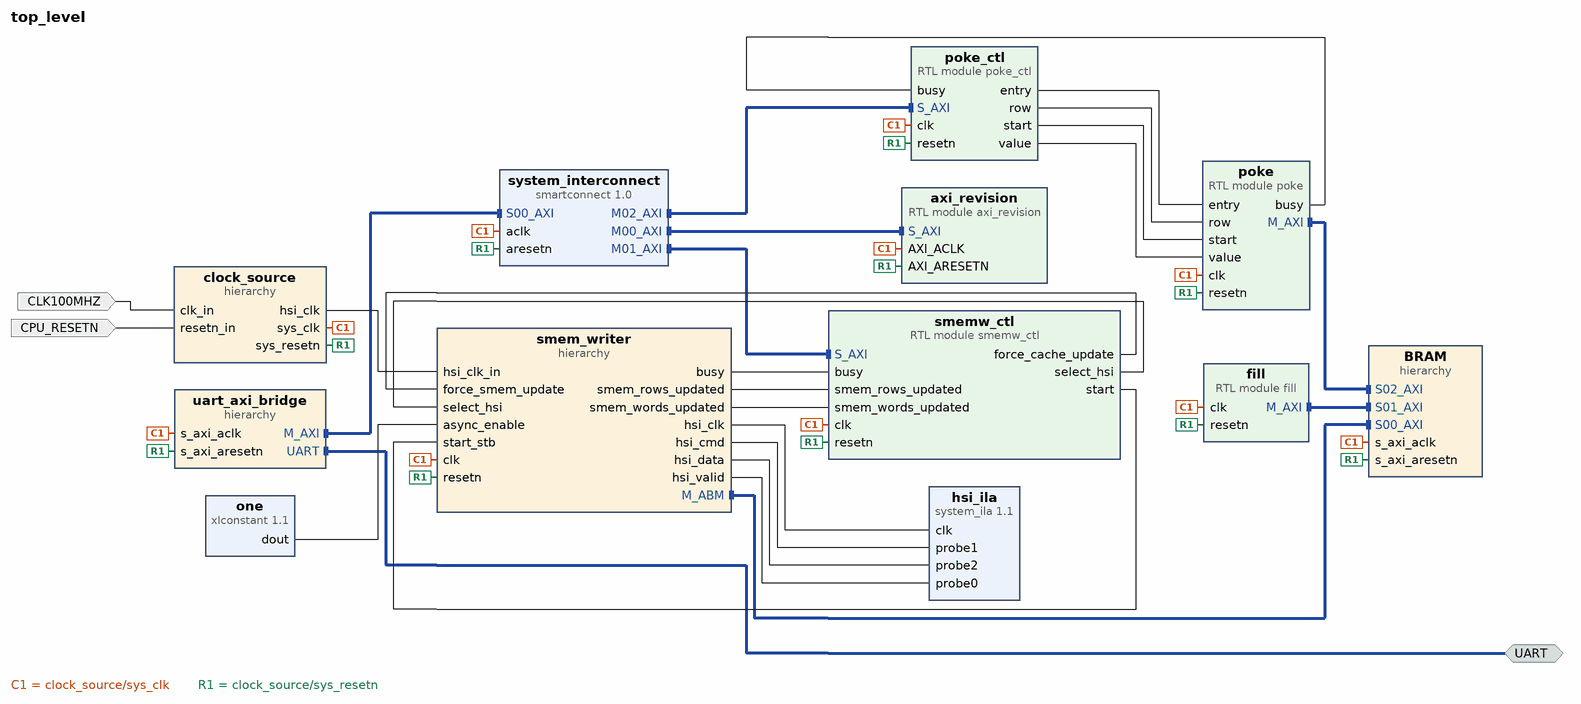
[diagram p0: block diagram of the top level]
# Vivado block design top_level, xc7a100tcsg324-1, Vivado 2021.1
create_bd_design top_level

create_bd_intf_port -mode Master -vlnv xilinx.com:interface:uart_rtl:1.0 UART
create_bd_port -dir I -type clk CLK100MHZ
create_bd_port -dir I -type rst CPU_RESETN

create_bd_cell -type hier clock_source
create_bd_cell -type hier uart_axi_bridge
create_bd_cell -type ip -vlnv xilinx.com:ip:smartconnect:1.0 system_interconnect
set_property -dict {CONFIG.NUM_MI 3 CONFIG.NUM_SI 1} [get_bd_cells system_interconnect]
create_bd_cell -type module -reference axi_revision axi_revision
create_bd_cell -type hier BRAM
create_bd_cell -type module -reference poke_ctl poke_ctl
create_bd_cell -type hier smem_writer
create_bd_cell -type ip -vlnv xilinx.com:ip:xlconstant:1.1 one
create_bd_cell -type ip -vlnv xilinx.com:ip:system_ila:1.1 hsi_ila
set_property -dict [list \
  CONFIG.C_MON_TYPE NATIVE \
  CONFIG.C_NUM_OF_PROBES 3 \
  CONFIG.C_SLOT_0_INTF_TYPE xilinx.com:interface:axis_rtl:1.0 \
] [get_bd_cells hsi_ila]
create_bd_cell -type module -reference smemw_ctl smemw_ctl
create_bd_cell -type module -reference fill fill
create_bd_cell -type module -reference poke poke

# ---- hierarchy /clock_source ----
current_bd_instance /clock_source
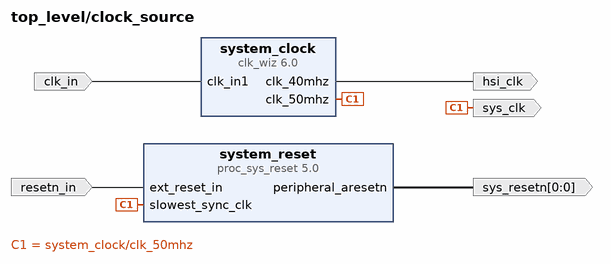
[diagram p1: block diagram inside /clock_source]
create_bd_pin -dir I -type clk clk_in
create_bd_pin -dir I -type rst resetn_in
create_bd_pin -dir O -type clk sys_clk
create_bd_pin -dir O -from 0 -to 0 sys_resetn
create_bd_pin -dir O hsi_clk

create_bd_cell -type ip -vlnv xilinx.com:ip:clk_wiz:6.0 system_clock
set_property -dict [list \
  CONFIG.CLKOUT1_JITTER 151.636 \
  CONFIG.CLKOUT1_REQUESTED_OUT_FREQ 50.00 \
  CONFIG.CLKOUT2_JITTER 159.371 \
  CONFIG.CLKOUT2_PHASE_ERROR 98.575 \
  CONFIG.CLKOUT2_REQUESTED_OUT_FREQ 40.00 \
  CONFIG.CLKOUT2_USED true \
  CONFIG.CLK_OUT1_PORT clk_50mhz \
  CONFIG.CLK_OUT2_PORT clk_40mhz \
  CONFIG.MMCM_CLKOUT0_DIVIDE_F 20.000 \
  CONFIG.MMCM_CLKOUT1_DIVIDE 25 \
  CONFIG.NUM_OUT_CLKS 2 \
  CONFIG.USE_LOCKED false \
  CONFIG.USE_RESET false \
] [get_bd_cells system_clock]
create_bd_cell -type ip -vlnv xilinx.com:ip:proc_sys_reset:5.0 system_reset

# ---- hierarchy /uart_axi_bridge ----
current_bd_instance /uart_axi_bridge
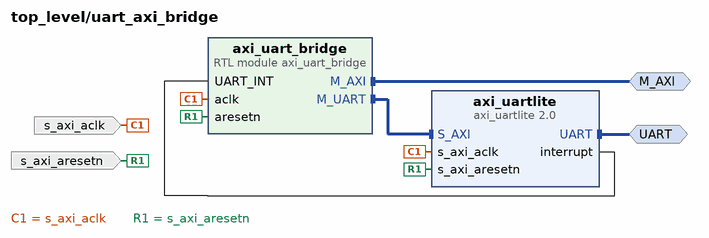
[diagram p2: block diagram inside /uart_axi_bridge]
create_bd_intf_pin -mode Master -vlnv xilinx.com:interface:uart_rtl:1.0 UART
create_bd_intf_pin -mode Master -vlnv xilinx.com:interface:aximm_rtl:1.0 M_AXI
create_bd_pin -dir I -type clk s_axi_aclk
create_bd_pin -dir I -type rst s_axi_aresetn

create_bd_cell -type module -reference axi_uart_bridge axi_uart_bridge
create_bd_cell -type ip -vlnv xilinx.com:ip:axi_uartlite:2.0 axi_uartlite
set_property -dict {CONFIG.C_BAUDRATE 115200} [get_bd_cells axi_uartlite]

# ---- hierarchy /BRAM ----
current_bd_instance /BRAM
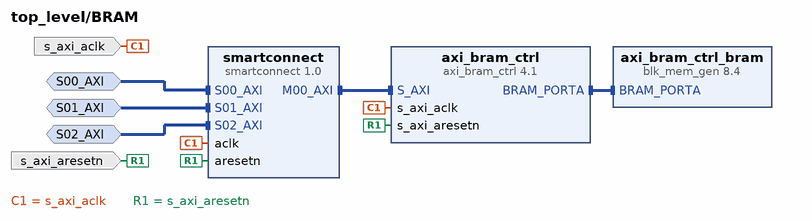
[diagram p3: block diagram inside /BRAM]
create_bd_intf_pin -mode Slave -vlnv xilinx.com:interface:aximm_rtl:1.0 S00_AXI
create_bd_intf_pin -mode Slave -vlnv xilinx.com:interface:aximm_rtl:1.0 S01_AXI
create_bd_intf_pin -mode Slave -vlnv xilinx.com:interface:aximm_rtl:1.0 S02_AXI
create_bd_pin -dir I -type clk s_axi_aclk
create_bd_pin -dir I -type rst s_axi_aresetn

create_bd_cell -type ip -vlnv xilinx.com:ip:axi_bram_ctrl:4.1 axi_bram_ctrl
set_property -dict {CONFIG.DATA_WIDTH 512 CONFIG.SINGLE_PORT_BRAM 1} [get_bd_cells axi_bram_ctrl]
create_bd_cell -type ip -vlnv xilinx.com:ip:blk_mem_gen:8.4 axi_bram_ctrl_bram
create_bd_cell -type ip -vlnv xilinx.com:ip:smartconnect:1.0 smartconnect
set_property -dict {CONFIG.NUM_SI 3} [get_bd_cells smartconnect]

# ---- hierarchy /smem_writer ----
current_bd_instance /smem_writer
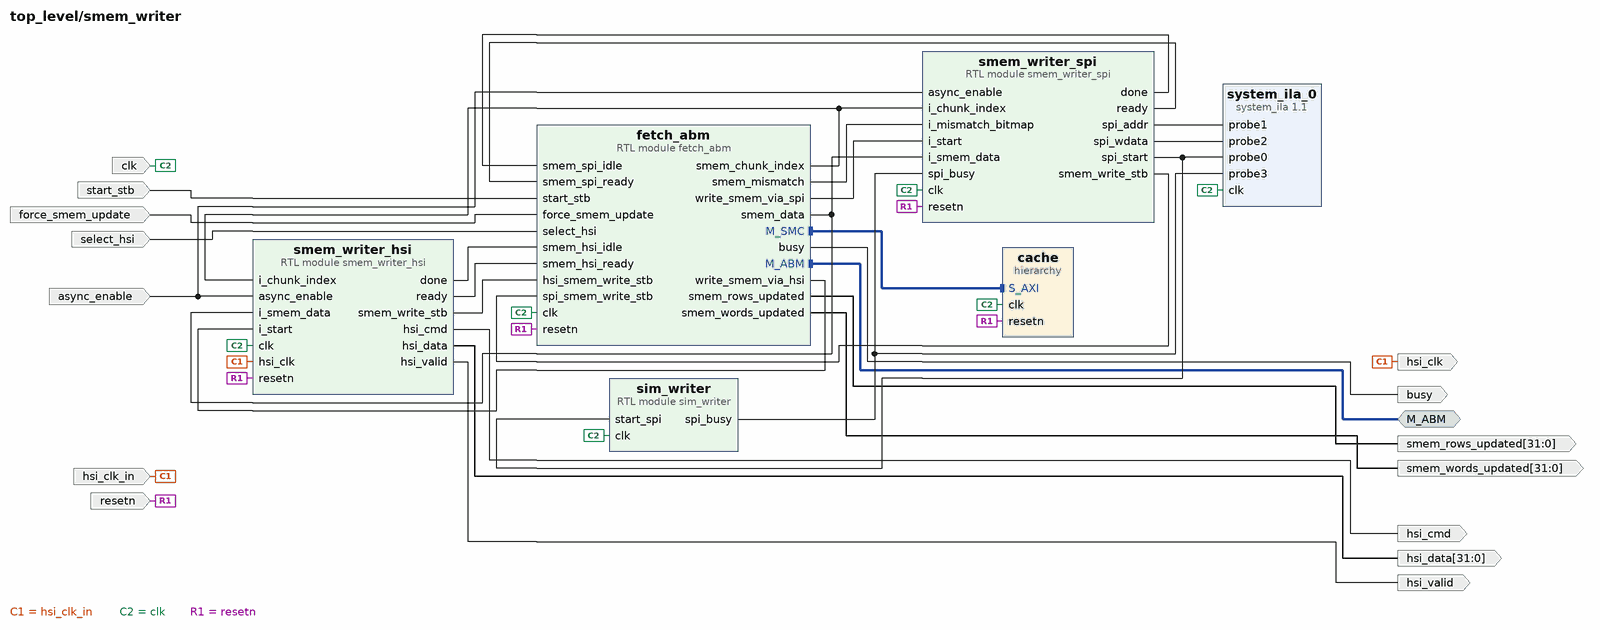
[diagram p4: block diagram inside /smem_writer]
create_bd_intf_pin -mode Master -vlnv xilinx.com:interface:aximm_rtl:1.0 M_ABM
create_bd_pin -dir I -type clk clk
create_bd_pin -dir I -type rst resetn
create_bd_pin -dir I start_stb
create_bd_pin -dir I select_hsi
create_bd_pin -dir I async_enable
create_bd_pin -dir I hsi_clk_in
create_bd_pin -dir O -from 31 -to 0 hsi_data
create_bd_pin -dir O hsi_cmd
create_bd_pin -dir O hsi_valid
create_bd_pin -dir O hsi_clk
create_bd_pin -dir I force_smem_update
create_bd_pin -dir O -from 31 -to 0 smem_rows_updated
create_bd_pin -dir O -from 31 -to 0 smem_words_updated
create_bd_pin -dir O busy

create_bd_cell -type hier cache
create_bd_cell -type ip -vlnv xilinx.com:ip:system_ila:1.1 system_ila_0
set_property -dict [list \
  CONFIG.C_DATA_DEPTH 2048 \
  CONFIG.C_MON_TYPE NATIVE \
  CONFIG.C_NUM_MONITOR_SLOTS 2 \
  CONFIG.C_NUM_OF_PROBES 4 \
  CONFIG.C_SLOT 1 \
  CONFIG.C_SLOT_0_INTF_TYPE xilinx.com:interface:axis_rtl:1.0 \
  CONFIG.C_SLOT_1_INTF_TYPE xilinx.com:interface:axis_rtl:1.0 \
] [get_bd_cells system_ila_0]
create_bd_cell -type module -reference sim_writer sim_writer
create_bd_cell -type module -reference smem_writer_spi smem_writer_spi
create_bd_cell -type module -reference smem_writer_hsi smem_writer_hsi
create_bd_cell -type module -reference fetch_abm fetch_abm
set_property -dict {CONFIG.BRAM_SIZE 0x00001000} [get_bd_cells fetch_abm]

# ---- hierarchy /smem_writer/cache ----
current_bd_instance /smem_writer/cache
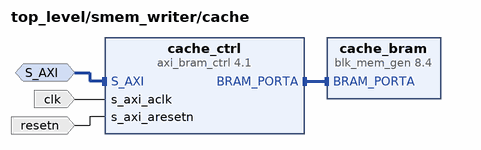
[diagram p5: block diagram inside /smem_writer/cache]
create_bd_intf_pin -mode Slave -vlnv xilinx.com:interface:aximm_rtl:1.0 S_AXI
create_bd_pin -dir I -type clk clk
create_bd_pin -dir I -type rst resetn

create_bd_cell -type ip -vlnv xilinx.com:ip:axi_bram_ctrl:4.1 cache_ctrl
set_property -dict {CONFIG.DATA_WIDTH 512 CONFIG.SINGLE_PORT_BRAM 1} [get_bd_cells cache_ctrl]
create_bd_cell -type ip -vlnv xilinx.com:ip:blk_mem_gen:8.4 cache_bram

# ---- connections ----

current_bd_instance /clock_source
connect_bd_net -net clk_in1_0_1 [get_bd_pins clk_in] [get_bd_pins system_clock/clk_in1]
connect_bd_net -net ext_reset_in_0_1 [get_bd_pins resetn_in] [get_bd_pins system_reset/ext_reset_in]
connect_bd_net -net system_clock_clk_100mhz [get_bd_pins system_clock/clk_50mhz] [get_bd_pins sys_clk] [get_bd_pins system_reset/slowest_sync_clk]
connect_bd_net [get_bd_pins system_clock/clk_40mhz] [get_bd_pins hsi_clk]
connect_bd_net [get_bd_pins system_reset/peripheral_aresetn] [get_bd_pins sys_resetn]

current_bd_instance /uart_axi_bridge
connect_bd_intf_net [get_bd_intf_pins M_AXI] [get_bd_intf_pins axi_uart_bridge/M_AXI]
connect_bd_intf_net [get_bd_intf_pins axi_uart_bridge/M_UART] [get_bd_intf_pins axi_uartlite/S_AXI]
connect_bd_intf_net [get_bd_intf_pins UART] [get_bd_intf_pins axi_uartlite/UART]
connect_bd_net [get_bd_pins axi_uartlite/interrupt] [get_bd_pins axi_uart_bridge/UART_INT]
connect_bd_net -net source_100mhz_sys_clk [get_bd_pins s_axi_aclk] [get_bd_pins axi_uartlite/s_axi_aclk] [get_bd_pins axi_uart_bridge/aclk]
connect_bd_net -net source_100mhz_sys_resetn [get_bd_pins s_axi_aresetn] \
  [get_bd_pins axi_uartlite/s_axi_aresetn] [get_bd_pins axi_uart_bridge/aresetn]

current_bd_instance /BRAM
connect_bd_intf_net [get_bd_intf_pins S00_AXI] [get_bd_intf_pins smartconnect/S00_AXI]
connect_bd_intf_net [get_bd_intf_pins S01_AXI] [get_bd_intf_pins smartconnect/S01_AXI]
connect_bd_intf_net [get_bd_intf_pins S02_AXI] [get_bd_intf_pins smartconnect/S02_AXI]
connect_bd_intf_net [get_bd_intf_pins axi_bram_ctrl_bram/BRAM_PORTA] [get_bd_intf_pins axi_bram_ctrl/BRAM_PORTA]
connect_bd_intf_net -intf_net smartconnect_0_M00_AXI [get_bd_intf_pins smartconnect/M00_AXI] [get_bd_intf_pins axi_bram_ctrl/S_AXI]
connect_bd_net -net source_100mhz_sys_clk [get_bd_pins s_axi_aclk] [get_bd_pins axi_bram_ctrl/s_axi_aclk] [get_bd_pins smartconnect/aclk]
connect_bd_net -net source_100mhz_sys_resetn [get_bd_pins s_axi_aresetn] [get_bd_pins axi_bram_ctrl/s_axi_aresetn] [get_bd_pins smartconnect/aresetn]

current_bd_instance /smem_writer
connect_bd_intf_net [get_bd_intf_pins M_ABM] [get_bd_intf_pins fetch_abm/M_ABM]
connect_bd_intf_net -intf_net fetch_abm_M_SHA [get_bd_intf_pins fetch_abm/M_SMC] [get_bd_intf_pins cache/S_AXI]
connect_bd_net [get_bd_pins async_enable] [get_bd_pins smem_writer_spi/async_enable] [get_bd_pins smem_writer_hsi/async_enable]
connect_bd_net -net example_slave_start [get_bd_pins start_stb] [get_bd_pins fetch_abm/start_stb]
connect_bd_net [get_bd_pins fetch_abm/busy] [get_bd_pins busy]
connect_bd_net [get_bd_pins fetch_abm/smem_chunk_index] [get_bd_pins smem_writer_spi/i_chunk_index] [get_bd_pins smem_writer_hsi/i_chunk_index]
connect_bd_net [get_bd_pins fetch_abm/smem_data] [get_bd_pins smem_writer_spi/i_smem_data] [get_bd_pins smem_writer_hsi/i_smem_data]
connect_bd_net [get_bd_pins fetch_abm/smem_mismatch] [get_bd_pins smem_writer_spi/i_mismatch_bitmap]
connect_bd_net [get_bd_pins fetch_abm/smem_rows_updated] [get_bd_pins smem_rows_updated]
connect_bd_net -net fetch_abm_smem_words_update [get_bd_pins fetch_abm/smem_words_updated] [get_bd_pins smem_words_updated]
connect_bd_net [get_bd_pins fetch_abm/write_smem_via_hsi] [get_bd_pins smem_writer_hsi/i_start]
connect_bd_net [get_bd_pins fetch_abm/write_smem_via_spi] [get_bd_pins smem_writer_spi/i_start]
connect_bd_net [get_bd_pins force_smem_update] [get_bd_pins fetch_abm/force_smem_update]
connect_bd_net -net hsi_clk_1 [get_bd_pins hsi_clk_in] [get_bd_pins hsi_clk] [get_bd_pins smem_writer_hsi/hsi_clk]
connect_bd_net [get_bd_pins select_hsi] [get_bd_pins fetch_abm/select_hsi]
connect_bd_net [get_bd_pins sim_writer/spi_busy] [get_bd_pins system_ila_0/probe3] [get_bd_pins smem_writer_spi/spi_busy]
connect_bd_net [get_bd_pins smem_writer_hsi/done] [get_bd_pins fetch_abm/smem_hsi_idle]
connect_bd_net [get_bd_pins smem_writer_hsi/hsi_cmd] [get_bd_pins hsi_cmd]
connect_bd_net [get_bd_pins smem_writer_hsi/hsi_data] [get_bd_pins hsi_data]
connect_bd_net [get_bd_pins smem_writer_hsi/hsi_valid] [get_bd_pins hsi_valid]
connect_bd_net [get_bd_pins smem_writer_hsi/ready] [get_bd_pins fetch_abm/smem_hsi_ready]
connect_bd_net [get_bd_pins smem_writer_hsi/smem_write_stb] [get_bd_pins fetch_abm/hsi_smem_write_stb]
connect_bd_net -net smem_writer_spi_0_done [get_bd_pins smem_writer_spi/done] [get_bd_pins fetch_abm/smem_spi_idle]
connect_bd_net -net smem_writer_spi_0_ready [get_bd_pins smem_writer_spi/ready] [get_bd_pins fetch_abm/smem_spi_ready]
connect_bd_net -net smem_writer_spi_0_spi_addr [get_bd_pins smem_writer_spi/spi_addr] [get_bd_pins system_ila_0/probe1]
connect_bd_net -net smem_writer_spi_0_spi_start [get_bd_pins smem_writer_spi/spi_start] \
  [get_bd_pins system_ila_0/probe0] [get_bd_pins sim_writer/start_spi]
connect_bd_net -net smem_writer_spi_0_spi_wdata [get_bd_pins smem_writer_spi/spi_wdata] [get_bd_pins system_ila_0/probe2]
connect_bd_net [get_bd_pins smem_writer_spi/smem_write_stb] [get_bd_pins fetch_abm/spi_smem_write_stb]
connect_bd_net -net source_100mhz_sys_clk [get_bd_pins clk] \
  [get_bd_pins cache/clk] [get_bd_pins system_ila_0/clk] [get_bd_pins sim_writer/clk] [get_bd_pins smem_writer_spi/clk] \
  [get_bd_pins smem_writer_hsi/clk] [get_bd_pins fetch_abm/clk]
connect_bd_net -net source_100mhz_sys_resetn [get_bd_pins resetn] \
  [get_bd_pins cache/resetn] [get_bd_pins smem_writer_spi/resetn] [get_bd_pins smem_writer_hsi/resetn] \
  [get_bd_pins fetch_abm/resetn]

current_bd_instance /smem_writer/cache
connect_bd_intf_net -intf_net axi_bram_ctrl_BRAM_PORTA [get_bd_intf_pins cache_bram/BRAM_PORTA] [get_bd_intf_pins cache_ctrl/BRAM_PORTA]
connect_bd_intf_net -intf_net fetch_abm_M_SHA [get_bd_intf_pins S_AXI] [get_bd_intf_pins cache_ctrl/S_AXI]
connect_bd_net -net source_100mhz_sys_clk [get_bd_pins clk] [get_bd_pins cache_ctrl/s_axi_aclk]
connect_bd_net -net source_100mhz_sys_resetn [get_bd_pins resetn] [get_bd_pins cache_ctrl/s_axi_aresetn]

current_bd_instance /
connect_bd_intf_net -intf_net axi_uartlite_UART [get_bd_intf_ports UART] [get_bd_intf_pins uart_axi_bridge/UART]
connect_bd_intf_net -intf_net fill_0_M_AXI [get_bd_intf_pins fill/M_AXI] [get_bd_intf_pins BRAM/S01_AXI]
connect_bd_intf_net -intf_net fill_smem_s1_0_M_AXI [get_bd_intf_pins smem_writer/M_ABM] [get_bd_intf_pins BRAM/S00_AXI]
connect_bd_intf_net -intf_net poke_0_M_AXI [get_bd_intf_pins poke/M_AXI] [get_bd_intf_pins BRAM/S02_AXI]
connect_bd_intf_net [get_bd_intf_pins system_interconnect/M00_AXI] [get_bd_intf_pins axi_revision/S_AXI]
connect_bd_intf_net [get_bd_intf_pins smemw_ctl/S_AXI] [get_bd_intf_pins system_interconnect/M01_AXI]
connect_bd_intf_net [get_bd_intf_pins system_interconnect/M02_AXI] [get_bd_intf_pins poke_ctl/S_AXI]
connect_bd_intf_net [get_bd_intf_pins uart_axi_bridge/M_AXI] [get_bd_intf_pins system_interconnect/S00_AXI]
connect_bd_net -net clk_in1_0_1 [get_bd_ports CLK100MHZ] [get_bd_pins clock_source/clk_in]
connect_bd_net [get_bd_pins clock_source/hsi_clk] [get_bd_pins smem_writer/hsi_clk_in]
connect_bd_net -net ext_reset_in_0_1 [get_bd_ports CPU_RESETN] [get_bd_pins clock_source/resetn_in]
connect_bd_net [get_bd_pins one/dout] [get_bd_pins smem_writer/async_enable]
connect_bd_net [get_bd_pins poke/busy] [get_bd_pins poke_ctl/busy]
connect_bd_net [get_bd_pins poke_ctl/entry] [get_bd_pins poke/entry]
connect_bd_net [get_bd_pins poke_ctl/row] [get_bd_pins poke/row]
connect_bd_net [get_bd_pins poke_ctl/start] [get_bd_pins poke/start]
connect_bd_net [get_bd_pins poke_ctl/value] [get_bd_pins poke/value]
connect_bd_net [get_bd_pins smem_writer/busy] [get_bd_pins smemw_ctl/busy]
connect_bd_net [get_bd_pins smem_writer/hsi_clk] [get_bd_pins hsi_ila/clk]
connect_bd_net [get_bd_pins smem_writer/hsi_cmd] [get_bd_pins hsi_ila/probe1]
connect_bd_net [get_bd_pins smem_writer/hsi_data] [get_bd_pins hsi_ila/probe2]
connect_bd_net [get_bd_pins smem_writer/hsi_valid] [get_bd_pins hsi_ila/probe0]
connect_bd_net [get_bd_pins smem_writer/smem_rows_updated] [get_bd_pins smemw_ctl/smem_rows_updated]
connect_bd_net -net smem_writer_smem_words_update [get_bd_pins smem_writer/smem_words_updated] [get_bd_pins smemw_ctl/smem_words_updated]
connect_bd_net [get_bd_pins smemw_ctl/force_cache_update] [get_bd_pins smem_writer/force_smem_update]
connect_bd_net [get_bd_pins smemw_ctl/select_hsi] [get_bd_pins smem_writer/select_hsi]
connect_bd_net [get_bd_pins smemw_ctl/start] [get_bd_pins smem_writer/start_stb]
connect_bd_net -net source_100mhz_sys_clk [get_bd_pins clock_source/sys_clk] \
  [get_bd_pins uart_axi_bridge/s_axi_aclk] [get_bd_pins system_interconnect/aclk] [get_bd_pins axi_revision/AXI_ACLK] \
  [get_bd_pins BRAM/s_axi_aclk] [get_bd_pins poke_ctl/clk] [get_bd_pins smem_writer/clk] [get_bd_pins smemw_ctl/clk] \
  [get_bd_pins fill/clk] [get_bd_pins poke/clk]
connect_bd_net -net source_100mhz_sys_resetn [get_bd_pins clock_source/sys_resetn] \
  [get_bd_pins uart_axi_bridge/s_axi_aresetn] [get_bd_pins system_interconnect/aresetn] \
  [get_bd_pins axi_revision/AXI_ARESETN] [get_bd_pins BRAM/s_axi_aresetn] [get_bd_pins poke_ctl/resetn] \
  [get_bd_pins smem_writer/resetn] [get_bd_pins smemw_ctl/resetn] [get_bd_pins fill/resetn] [get_bd_pins poke/resetn]

# ---- address map ----
assign_bd_address -offset 0x00000 -range 4K -target_address_space [get_bd_addr_spaces fill/M_AXI] [get_bd_addr_segs BRAM/axi_bram_ctrl/S_AXI/Mem0]
assign_bd_address -offset 0x00000 -range 4K -target_address_space [get_bd_addr_spaces poke/M_AXI] [get_bd_addr_segs BRAM/axi_bram_ctrl/S_AXI/Mem0]
assign_bd_address -offset 0x00000 -range 4K -target_address_space [get_bd_addr_spaces smem_writer/fetch_abm/M_ABM] [get_bd_addr_segs BRAM/axi_bram_ctrl/S_AXI/Mem0]
assign_bd_address -offset 0x00000 -range 4K -target_address_space [get_bd_addr_spaces smem_writer/fetch_abm/M_SMC] [get_bd_addr_segs smem_writer/cache/cache_ctrl/S_AXI/Mem0]
assign_bd_address -offset 0x0000000000000000 -range 256 -target_address_space [get_bd_addr_spaces uart_axi_bridge/axi_uart_bridge/M_AXI] [get_bd_addr_segs axi_revision/S_AXI/reg0]
assign_bd_address -offset 0x0000000000001000 -range 256 -target_address_space [get_bd_addr_spaces uart_axi_bridge/axi_uart_bridge/M_AXI] [get_bd_addr_segs poke_ctl/S_AXI/reg0]
assign_bd_address -offset 0x0000000000002000 -range 256 -target_address_space [get_bd_addr_spaces uart_axi_bridge/axi_uart_bridge/M_AXI] [get_bd_addr_segs smemw_ctl/S_AXI/reg0]
assign_bd_address -offset 0x40600000 -range 64K -target_address_space [get_bd_addr_spaces uart_axi_bridge/axi_uart_bridge/M_UART] [get_bd_addr_segs uart_axi_bridge/axi_uartlite/S_AXI/Reg]

validate_bd_design
save_bd_design
